# Altium project DC Link Non-Isolated.PrjPcb
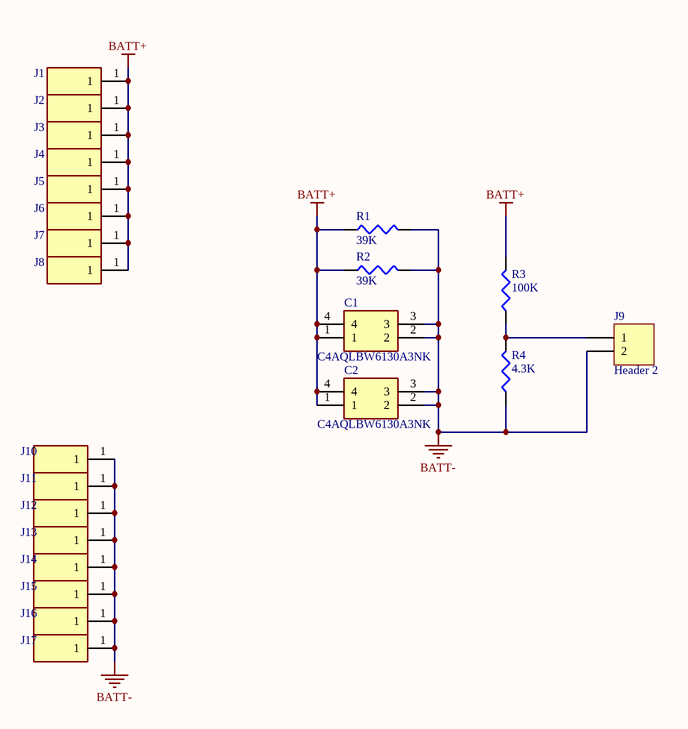
[diagram p0: DC Link Non-Isolated.SchDoc]
1 sheet, 23 parts. Net scope: global (net labels, ports and power ports of the same name join across sheets).
Board file: DC Link Non-Isolated.PcbDoc

## Sheet DC Link Non-Isolated.SchDoc
size A4

### Parts
C1  C4AQLBW6130A3NK  [C4AQLBW6130A3NK]
C2  C4AQLBW6130A3NK  [C4AQLBW6130A3NK]
J1  8730  [8730]  (value not drawn)
J2  8730  [8730]  (value not drawn)
J3  8730  [8730]  (value not drawn)
J4  8730  [8730]  (value not drawn)
J5  8730  [8730]  (value not drawn)
J6  8730  [8730]  (value not drawn)
J7  8730  [8730]  (value not drawn)
J8  8730  [8730]  (value not drawn)
J9  Header 2  [HDR1X2]
J10  8730  [8730]  (value not drawn)
J11  8730  [8730]  (value not drawn)
J12  8730  [8730]  (value not drawn)
J13  8730  [8730]  (value not drawn)
J14  8730  [8730]  (value not drawn)
J15  8730  [8730]  (value not drawn)
J16  8730  [8730]  (value not drawn)
J17  8730  [8730]  (value not drawn)
R1  value 39K  [C1206]  (hidden comment: Res3)
R2  value 39K  [C1206]  (hidden comment: Res3)
R3  value 100K  [J1-0603]  (hidden comment: Res3)
R4  value 4.3K  [J1-0603]  (hidden comment: Res3)

### Nets
BATT+: C1.1 C1.4 C2.1 C2.4 J1.1 J2.1 J3.1 J4.1 J5.1 J6.1 J7.1 J8.1 R1.1 R2.1 R3.2
BATT-: C1.2 C1.3 C2.2 C2.3 J9.2 J10.1 J11.1 J12.1 J13.1 J14.1 J15.1 J16.1 J17.1 R1.2 R2.2 R4.1
NetJ9_1: J9.1 R3.1 R4.2

### Library data of the parts
C1 C2 = C4AQLBW6130A3NK: Capacitor; Manufacturer_Name: Kemet; Datasheet Link: https://api.kemet.com/component-edge/download/specsheet/C4AQLBW6130A3NK.pdf; Height: 50.3mm; Manufacturer_Part_Number: C4AQLBW6130A3NK; Arrow Price/Stock: https://www.digikey.ca/en/products/detail/kemet/C4AQLBW6130A3NK/8345973; Mouser Part Number: C4AQLBW6130A3NK; Mouser Price/Stock: https://www.digikey.ca/en/products/detail/kemet/C4AQLBW6130A3NK/8345973; Arrow Part Number: C4AQLBW6130A3NK
J1-J8 J10-J17 = 8730: Connector; Manufacturer_Name: Keystone Electronics; Datasheet Link: https://www.mouser.com/datasheet/2/215/730-743759.pdf; Height: 4.88mm; Manufacturer_Part_Number: 8730; Arrow Part Number: 8730; Mouser Part Number: 534-8730; Mouser Price/Stock: https://www.mouser.co.uk/ProductDetail/Keystone-Electronics/8730?qs=%252B%252BPv0l39JAEHqkiHVP218w%3D%3D
J9 = Header 2: Header, 2-Pin; LatestRevisionDate: 17-Jul-2002; LatestRevisionNote: Re-released for DXP Platform.; Publisher: Altium Limited
R1-R4 = Res3: Resistor; Published: 8-Jun-2000; LatestRevisionDate: 29-May-2009; LatestRevisionNote: IPC-7351 Footprint Added.; PackageReference: J1-0603; Publisher: Altium Limited; PackageDescription: Chip Resistor